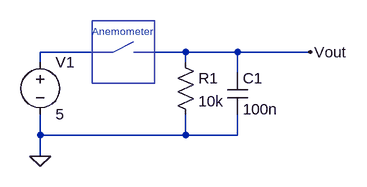
[diagram p0: schematic anenometer.asc]
anenometer.asc, the LTspice schematic file:
Version 4
SHEET 1 880 680
WIRE -416 96 -496 96
WIRE -272 96 -320 96
WIRE -192 96 -272 96
WIRE -80 96 -192 96
WIRE -496 112 -496 96
WIRE -272 112 -272 96
WIRE -192 128 -192 96
WIRE -496 224 -496 192
WIRE -272 224 -272 192
WIRE -272 224 -496 224
WIRE -192 224 -192 192
WIRE -192 224 -272 224
WIRE -496 256 -496 224
FLAG -496 256 0
FLAG -80 96 Vout
SYMBOL res -288 96 R0
SYMATTR InstName R1
SYMATTR Value 10k
SYMBOL cap -208 128 R0
SYMATTR InstName C1
SYMATTR Value 100n
SYMBOL voltage -496 96 R0
SYMATTR InstName V1
SYMATTR Value 5
TEXT -416 64 Left 1 ;Anemometer
LINE Normal -384 96 -416 96
LINE Normal -352 80 -384 96
LINE Normal -352 96 -320 96
RECTANGLE Normal -320 144 -416 48

The netlist it stands for:
* anenometer.asc
R1 Vout 0 10k
C1 Vout 0 100n
V1 N001 0 5
* Anemometer
.backanno
.end